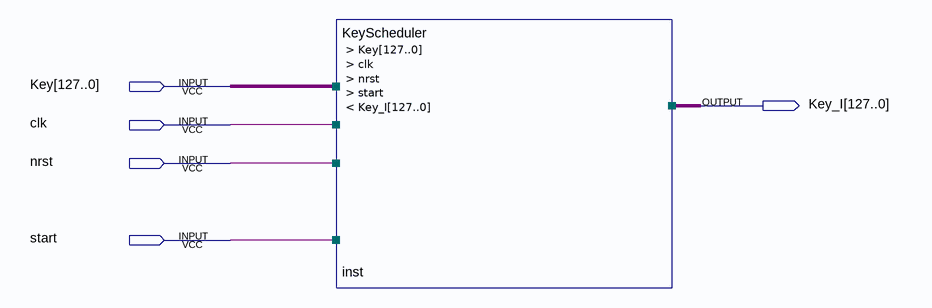
[diagram p0: schematic sheet]
// Quartus schematic KeySchedulerTopLevel.bdf as structural Verilog: 1 symbols, 5 pins
module KeySchedulerTopLevel (
  input  [127:0] Key,
  input  clk,
  input  nrst,
  input  start,
  output [127:0] Key_I
);

  KeyScheduler inst (.Key(Key), .clk(clk), .nrst(nrst), .start(start), .Key_I(Key_I));
endmodule
